# EAGLE schematic rpicam (EAGLE 7.1.0)
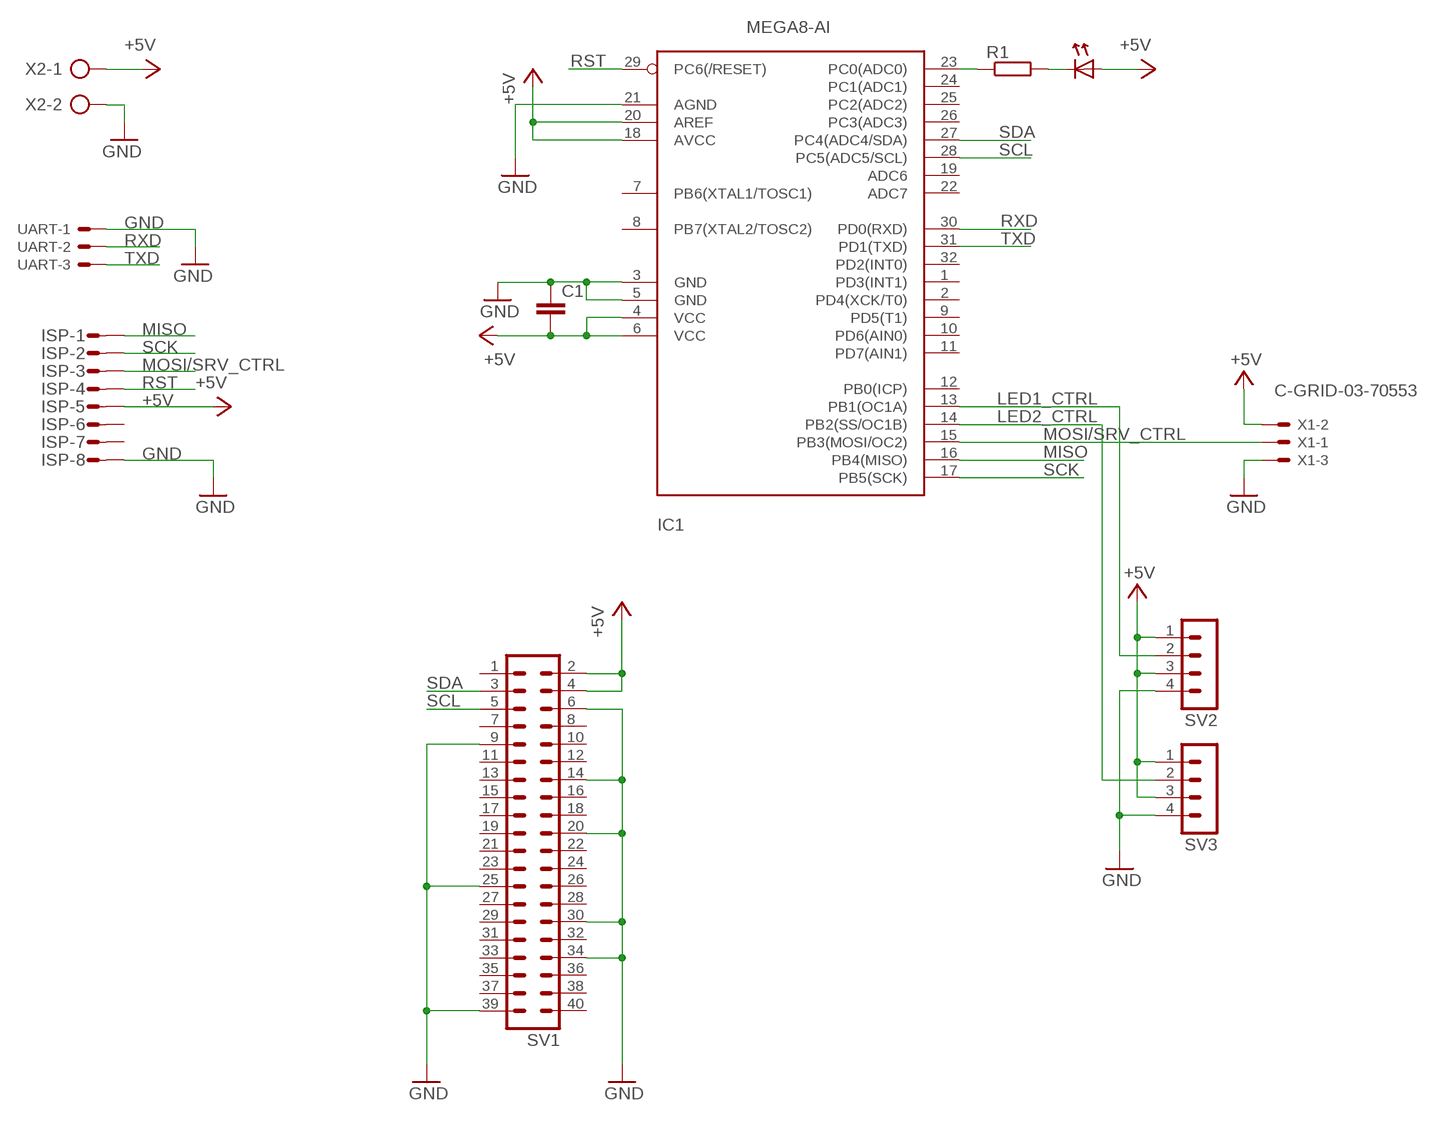
[diagram p0: schematic, sheet 1]

## Parts
C1  C-EUC0603  [C0603]
IC1  MEGA8-AI  [TQFP32-08]
ISP  MICROMATCH-8  [MICROMATCH-8]
R1  R-EU_R0603  [R0603]
SV1  MA20-2  [MA20-2]
SV2  MA04-1  [MA04-1]
SV3  MA04-1  [MA04-1]
U$1  LED0603  [D0603]
UART  uart  C-GRID-03-70553  [70553-03]
X1  C-GRID-03-70553  [70553-03]
X2  AK500/2  [AK500/2]

## Nets
+5V: C1.2 IC1.4(VCC) IC1.6(VCC) IC1.18(AVCC) IC1.20(AREF) ISP.5 SV1.2 SV1.4 SV2.1 SV2.3 SV3.1 SV3.3 U$1.1(A) X1.2 X2.1
GND: C1.1 IC1.3(GND) IC1.5(GND) IC1.21(AGND) ISP.8 SV1.6 SV1.9 SV1.14 SV1.20 SV1.25 SV1.30 SV1.34 SV1.39 SV2.4 SV3.4 UART.1 X1.3 X2.2
LED1_CTRL: IC1.13(PB1(OC1A)) SV2.2
LED2_CTRL: IC1.14(PB2(SS/OC1B)) SV3.2
MISO: IC1.16(PB4(MISO)) ISP.1
MOSI/SRV_CTRL: IC1.15(PB3(MOSI/OC2)) ISP.3 X1.1
N$1: R1.2 U$1.2(C)
N$4: IC1.23(PC0(ADC0)) R1.1
RST: IC1.29(PC6(/RESET)) ISP.4
RXD: IC1.30(PD0(RXD)) UART.2
SCK: IC1.17(PB5(SCK)) ISP.2
SCL: IC1.28(PC5(ADC5/SCL)) SV1.5
SDA: IC1.27(PC4(ADC4/SDA)) SV1.3
TXD: IC1.31(PD1(TXD)) UART.3
Unconnected: IC1.1(PD3(INT1)) IC1.2(PD4(XCK/T0)) IC1.7(PB6(XTAL1/TOSC1)) IC1.8(PB7(XTAL2/TOSC2)) IC1.9(PD5(T1)) IC1.10(PD6(AIN0)) IC1.11(PD7(AIN1)) IC1.12(PB0(ICP)) IC1.19(ADC6) IC1.22(ADC7) IC1.24(PC1(ADC1)) IC1.25(PC2(ADC2)) IC1.26(PC3(ADC3)) IC1.32(PD2(INT0)) ISP.6 ISP.7 SV1.1 SV1.7 SV1.8 SV1.10 SV1.11 SV1.12 SV1.13 SV1.15 SV1.16 SV1.17 SV1.18 SV1.19 SV1.21 SV1.22 SV1.23 SV1.24 SV1.26 SV1.27 SV1.28 SV1.29 SV1.31 SV1.32 SV1.33 SV1.35 SV1.36 SV1.37 SV1.38 SV1.40

## Library data of the parts
C1 = rcl:C-EU: CAPACITOR, European symbol
IC1 = atmel:MEGA8: MICROCONTROLLER 8 Kbytes FLASH, 1 kbytes SRAM, 512 bytes EEPROM, USART, 6-channel 10 bit ADC, 2-channel 8 bit ADC Pin compatible with Atmega48, ATMega88, ATMega168 Source: avr.lbr
ISP = con-amp-micromatch:MICROMATCH-8: MicroMaTch 8 7-215464-8 / 0-215464-8 Drawing Number C-215464 DDEController.pdf; MF: FARNELL; MPN: 7-215464-8; OC_FARNELL: 3784642; OC_NEWARK: 26H0301
R1 = rcl:R-EU_: RESISTOR, European symbol
SV1 = con-lstb:MA20-2: PIN HEADER; OC_FARNELL: unknown; OC_NEWARK: unknown
SV2 SV3 = con-lstb:MA04-1: PIN HEADER; OC_FARNELL: unknown; OC_NEWARK: unknown
U$1 = wb:LED0603
UART X1 = con-molex:C-GRID-03: CONNECTOR wire to board 2.54 mm (0.100") pitch header; OC_FARNELL: unknown; OC_NEWARK: unknown
X2 = con-ptr500:AK500/2: CONNECTOR; OC_FARNELL: unknown; OC_NEWARK: unknown